# Altium schematic sheet ir-rf.SchDoc
size A3
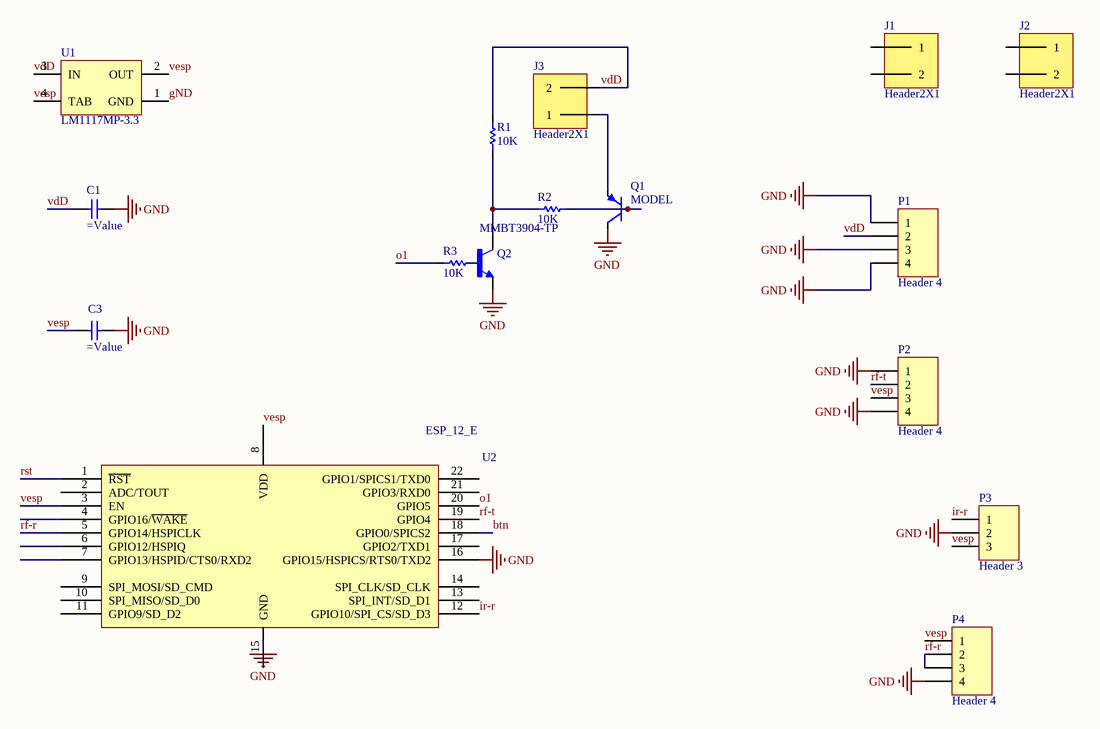
[diagram p0: ir-rf.SchDoc]

## Parts
C1  (no value)  [CAP 1206]
C3  (no value)  [CAP 0805]
J1  Header2X1  [Header 2X1]
J2  Header2X1  [Header 2X1]
J3  Header2X1  [Header 2X1]
P1  Header 4  [HDR1X4]
P2  Header 4  [HDR1X4]
P3  Header 3  [HDR1X3]
P4  Header 4  [HDR1X4]
Q1  MODEL  [TO-220]
Q2  MMBT3904-TP  [SOT23-3]
R1  10K  [RES 1206 (3216X08L)]
R2  10K  [RES 1206 (3216X08L)]
R3  10K  [RES 1206 (3216X08L)]
U1  LM1117MP-3.3  [MP04A_N]
U2  ESP_12_E  [ESP_12_E]

## Nets
gND: C1.2(-) C3.2(-) P1.1 P1.3 P1.4 P2.1 P2.4 P3.2 P4.4 Q1.2(C) Q2.2(E) U1.1(GND) U2.15(GND) U2.16(GPIO15/HSPICS/RTS0/TXD2)
btn: U2.18(GPIO0/SPICS2)
ir-r: P3.1 U2.12(GPIO10/SPI_CS/SD_D3)
o1: R3.1 U2.20(GPIO5)
rf-r: P4.2 P4.3 U2.5(GPIO14/HSPICLK)
rf-t: P2.2 U2.19(GPIO4)
rst: U2.1(~{RST})
vdD: C1.1(+) J3.2 P1.2 R1.2 U1.3(IN)
vesp: C3.1(+) P2.3 P3.3 P4.1 U1.2(OUT) U1.4(TAB) U2.3(EN) U2.8(VDD)
NetJ3_1: J3.1 Q1.3(E)
NetQ1_1: Q1.1(B) R2.2
NetQ2_1: Q2.1(B) R3.2
NetQ2_3: Q2.3(C) R1.1 R2.1

Not connected (* = marked no-connect by the designer): J1 1 2; J2 1 2; U2 2(ADC/TOUT) 4(GPIO16/~{WAKE}) 6(GPIO12/HSPIQ) 7(GPIO13/HSPID/CTS0/RXD2) 9(SPI_MOSI/SD_CMD) 10(SPI_MISO/SD_D0) 11(GPIO9/SD_D2) 13(SPI_INT/SD_D1) 14(SPI_CLK/SD_CLK) 17(GPIO2/TXD1) 21(GPIO3/RXD0) 22(GPIO1/SPICS1/TXD0)

## Library data of the parts
C1 C3 = Capacitor
P1 P2 P4 = Header 4: Header, 4-Pin; LatestRevisionDate: 17-Jul-2002; LatestRevisionNote: Re-released for DXP Platform.; Publisher: Altium Limited
P3 = Header 3: Header, 3-Pin; LatestRevisionDate: 17-Jul-2002; LatestRevisionNote: Re-released for DXP Platform.; Publisher: Altium Limited
Q1 = TIP127: PNP Bipolar Transistor
Q2 = MMBT3904-TP: Bipolar _BJT_ Transistor NPN 40V 200mA 300MHz 350mW Surface Mount SOT-23; MF: Micro Commercial; Value: *; MP: MMBT3904-TP; Package: SOT-23 Micro Commercial; Price: None; Availability: Unavailable; SnapEDA_Link: https://www.snapeda.com/parts/MMBT3904-TP/Micro%20Commercial/view-part/805928/?ref=snap
R1-R3 = Resistor: Tolerance: 5%; Power: 1/4 W; Value: 10K
U1 = LM1117MP-3.3: 800mA Low-Dropout Linear Regulator; Manufacturer: National Semiconductor; CompType: LDO IC; PackageTopMarking: XYTT*N05A; PowerWise: N; Published: 4-Dec-2008; DatasheetVersion: Apr-2006; PackageVersion: revB, Apr-2003; PackageReference: MP04A; Publisher: Altium Limited; PackageDescription: Molded SOT-223, 6.50 x 3.56 x 1.6mm Body, 4 Lead, 2.3mm Pitch; PartNumber: LM1117MP-3.3; RoHS: O; PinCount: 4; DigiKeyPartNumber: LM1117MP-3.3CT-ND; Code_JEDEC: TO-261-AA; Code_IPC: SOT223-4; ComponentLink1Description: LM1117 Datasheet; ComponentLink1URL: http://www.national.com/ds/LM/LM1117.pdf; ComponentLink2Description: LM1117 Web Page; ComponentLink2URL: http://www.national.com/pf/LM/LM1117.html; ComponentLink3Description: MP04A Package Page; ComponentLink3URL: http://www.national.com/packaging/folders/mp04a.html
U2 = ESP_12_E: ESP-12 Wi-Fi Module by AI-Thinker; IC: ESP8266-EX; Vendor: Ai-thinker